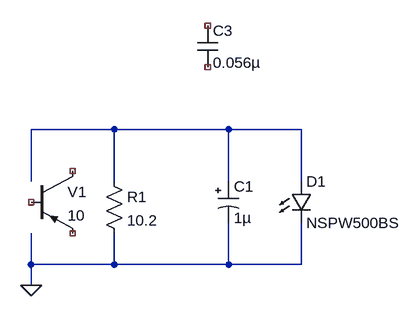
[diagram p0: schematic SYMBOLTYPE_TO_IMPLEMENT.asc]
SYMBOLTYPE_TO_IMPLEMENT.asc, the LTspice schematic file:
Version 4
SHEET 1 880 680
WIRE 320 16 192 16
WIRE 496 16 320 16
WIRE 608 16 496 16
WIRE 192 96 192 16
WIRE 320 96 320 16
WIRE 496 96 496 16
WIRE 608 96 608 16
WIRE 192 224 192 176
WIRE 320 224 320 176
WIRE 320 224 192 224
WIRE 496 224 496 160
WIRE 496 224 320 224
WIRE 608 224 608 160
WIRE 608 224 496 224
WIRE 192 256 192 224
FLAG 192 256 0
SYMBOL pnp 192 80 R0
WINDOW 123 0 0 Left 0
WINDOW 39 0 0 Left 0
SYMATTR InstName V1
SYMATTR Value 10
SYMBOL res 304 80 R0
SYMATTR InstName R1
SYMATTR Value 10.2
SYMATTR SpiceLine tol=1 pwr=0.1
SYMBOL polcap 480 96 R0
WINDOW 3 24 56 Left 2
SYMATTR InstName C1
SYMATTR Value 1µ
SYMATTR Description Capacitor
SYMATTR Type cap
SYMATTR SpiceLine V=50 Irms=36m Rser=3.5 Lser=0 mfg="Nichicon" pn="UPL1H010MAH" type="Al electrolytic"
SYMBOL LED 592 96 R0
SYMATTR InstName D1
SYMATTR Value NSPW500BS
SYMBOL cap 448 -144 R0
WINDOW 3 24 57 Left 2
SYMATTR InstName C3
SYMATTR Value 0.056µ
SYMATTR Description Polarized Capacitor
SYMATTR Type polcap
SYMATTR SpiceLine V=100 Irms=0 Rser=0 Lser=0 mfg="Murata" pn="GCM21BR72A563KA37" type="X7R"

The netlist it stands for:
* SYMBOLTYPE_TO_IMPLEMENT.asc
* V1: 10 (symbol pnp not certain, pin order unknown); nets seen at it: 0
R1 N001 0 10.2 tol=1 pwr=0.1
C1 N001 0 1µ V=50 Irms=36m Rser=3.5 Lser=0 mfg="Nichicon" pn="UPL1H010MAH" type="Al electrolytic"
D1 N001 0 NSPW500BS
C3 NC_04 NC_05 0.056µ V=100 Irms=0 Rser=0 Lser=0 mfg="Murata" pn="GCM21BR72A563KA37" type="X7R"
.model D D
.lib standard.dio
.backanno
.end